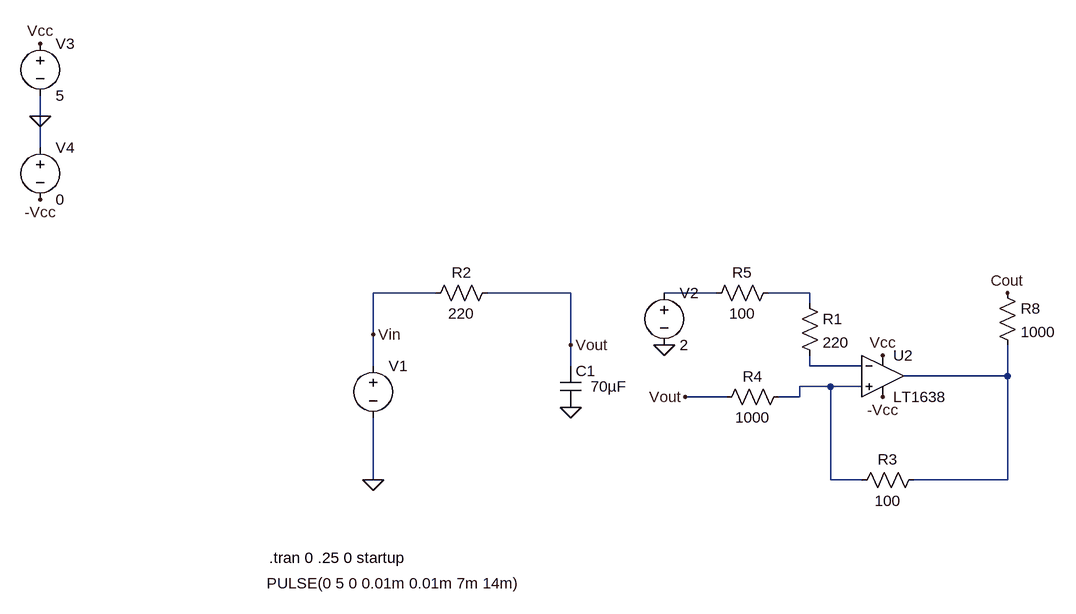
[diagram p0: schematic Low_pass_filter_comp_mel_3.asc]
Low_pass_filter_comp_mel_3.asc, the LTspice schematic file:
Version 4
SHEET 1 1848 680
WIRE -576 -352 -576 -384
WIRE -576 -304 -576 -352
WIRE 32 -80 -64 -80
WIRE 240 -80 112 -80
WIRE 464 -80 384 -80
WIRE 608 -80 544 -80
WIRE 608 -64 608 -80
WIRE -64 -16 -64 -80
WIRE 240 0 240 -80
WIRE -64 32 -64 -16
WIRE 240 32 240 0
WIRE 608 32 608 16
WIRE 688 32 608 32
WIRE 912 48 912 0
WIRE 912 48 752 48
WIRE 640 64 592 64
WIRE 688 64 640 64
WIRE 480 80 416 80
WIRE 592 80 592 64
WIRE 592 80 560 80
WIRE -64 208 -64 112
WIRE 640 208 640 64
WIRE 688 208 640 208
WIRE 912 208 912 48
WIRE 912 208 768 208
FLAG -64 208 0
FLAG -64 -16 Vin
FLAG 240 0 Vout
FLAG -576 -352 0
FLAG -576 -464 Vcc
FLAG -576 -224 -Vcc
FLAG 720 16 Vcc
FLAG 720 80 -Vcc
FLAG 416 80 Vout
FLAG 384 0 0
FLAG 240 96 0
FLAG 912 -80 Cout
SYMBOL voltage -64 16 R0
WINDOW 3 -164 351 Left 2
WINDOW 123 0 0 Left 0
WINDOW 39 0 0 Left 0
SYMATTR Value PULSE(0 5 0 0.01m 0.01m 7m 14m)
SYMATTR InstName V1
SYMBOL cap 224 32 R0
WINDOW 3 47 32 Left 2
SYMATTR Value 70µF
SYMATTR InstName C1
SYMBOL voltage -576 -480 R0
WINDOW 123 0 0 Left 0
WINDOW 39 0 0 Left 0
SYMATTR InstName V3
SYMATTR Value 5
SYMBOL voltage -576 -320 R0
WINDOW 123 0 0 Left 0
WINDOW 39 0 0 Left 0
SYMATTR InstName V4
SYMATTR Value 0
SYMBOL res 784 192 R90
WINDOW 0 0 56 VBottom 2
WINDOW 3 32 56 VTop 2
SYMATTR InstName R3
SYMATTR Value 100
SYMBOL res 576 64 R90
WINDOW 0 0 56 VBottom 2
WINDOW 3 32 56 VTop 2
SYMATTR InstName R4
SYMATTR Value 1000
SYMBOL res 592 -80 R0
SYMATTR InstName R1
SYMATTR Value 220
SYMBOL res 560 -96 R90
WINDOW 0 0 56 VBottom 2
WINDOW 3 32 56 VTop 2
SYMATTR InstName R5
SYMATTR Value 100
SYMBOL OpAmps\\LT1638 720 -16 R0
SYMATTR InstName U2
SYMBOL voltage 384 -96 R0
WINDOW 123 0 0 Left 0
WINDOW 39 0 0 Left 0
SYMATTR InstName V2
SYMATTR Value 2
SYMBOL res 128 -96 R90
WINDOW 0 0 56 VBottom 2
WINDOW 3 32 56 VTop 2
SYMATTR InstName R2
SYMATTR Value 220
SYMBOL res 896 -96 R0
SYMATTR InstName R8
SYMATTR Value 1000
TEXT -224 328 Left 2 !.tran 0 .25 0 startup

The netlist it stands for:
* Low_pass_filter_comp_mel_3.asc
V1 Vin 0 PULSE(0 5 0 0.01m 0.01m 7m 14m)
C1 Vout 0 70µF
V3 Vcc 0 5
V4 0 -Vcc 0
R3 N004 N005 100
R4 N005 Vout 1000
R1 N002 N003 220
R5 N002 N001 100
XU2 N005 N003 Vcc -Vcc N004 LT1638  ; pins In+ In- V+ V- OUT
V2 N001 0 2
R2 Vout Vin 220
R8 Cout N004 1000
.tran 0 .25 0 startup
.backanno
.end